# EAGLE design BRAMPS (EAGLE 7.3.0)
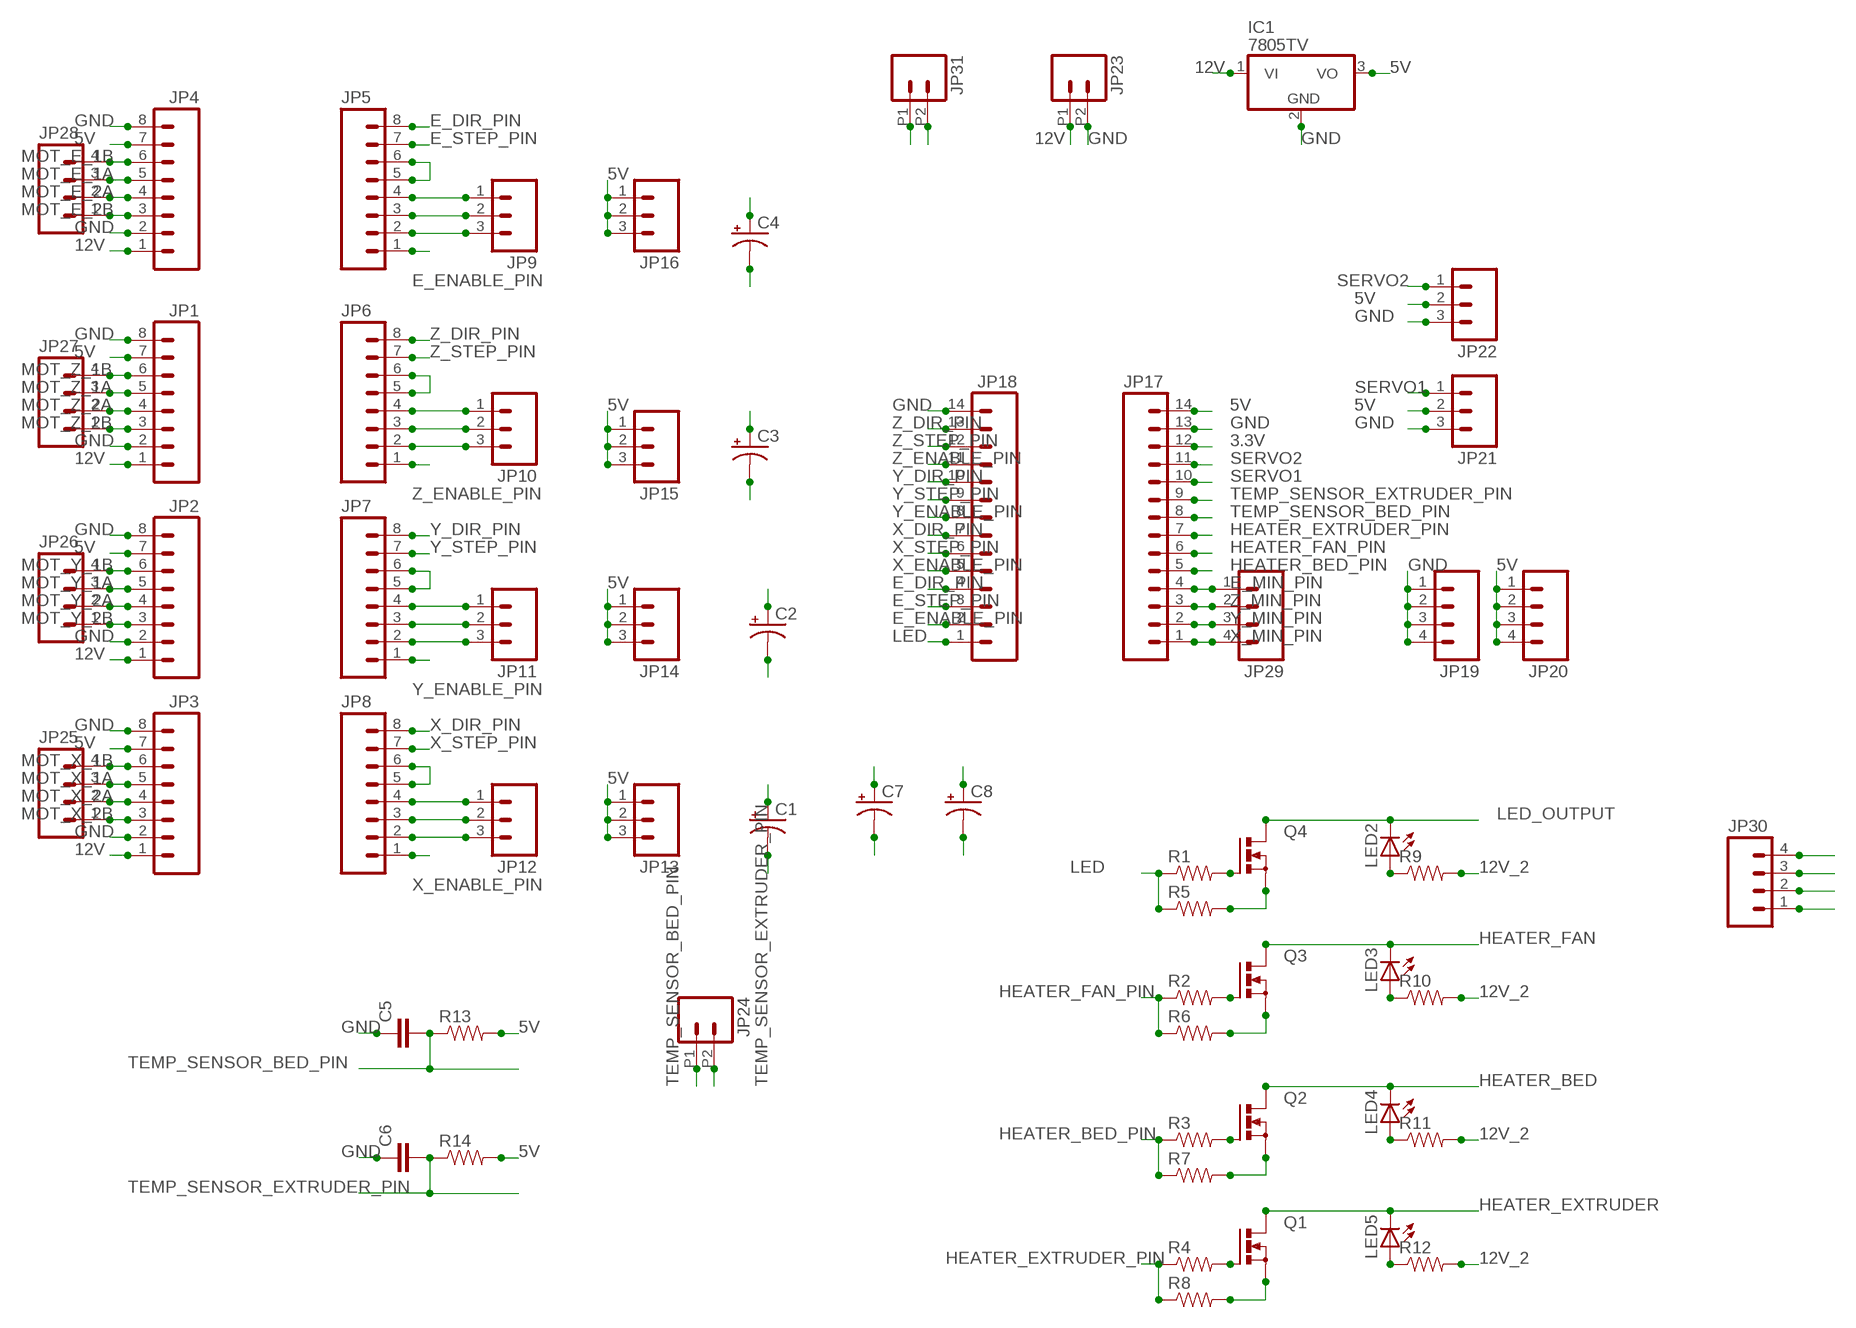
[diagram p0: schematic, sheet 1]

## Parts
C1  CAP_POLPTH2  [CPOL-RADIAL-10UF-25V]
C2  CAP_POLPTH2  [CPOL-RADIAL-10UF-25V]
C3  CAP_POLPTH2  [CPOL-RADIAL-10UF-25V]
C4  CAP_POLPTH2  [CPOL-RADIAL-10UF-25V]
C5  CAP0805  [0805]
C6  CAP0805  [0805]
C7  CAP_POLPTH2  [CPOL-RADIAL-10UF-25V]
C8  CAP_POLPTH2  [CPOL-RADIAL-10UF-25V]
IC1  7805TV  [TO220V]
JP1  M08NO_SILK_FEMALE_PTH  [1X08_NO_SILK]
JP2  M08NO_SILK_FEMALE_PTH  [1X08_NO_SILK]
JP3  M08NO_SILK_FEMALE_PTH  [1X08_NO_SILK]
JP4  M08NO_SILK_FEMALE_PTH  [1X08_NO_SILK]
JP5  M08NO_SILK_FEMALE_PTH  [1X08_NO_SILK]
JP6  M08NO_SILK_FEMALE_PTH  [1X08_NO_SILK]
JP7  M08NO_SILK_FEMALE_PTH  [1X08_NO_SILK]
JP8  M08NO_SILK_FEMALE_PTH  [1X08_NO_SILK]
JP9  M03PTH  [1X03]
JP10  M03PTH  [1X03]
JP11  M03PTH  [1X03]
JP12  M03PTH  [1X03]
JP13  M03PTH  [1X03]
JP14  M03PTH  [1X03]
JP15  M03PTH  [1X03]
JP16  M03PTH  [1X03]
JP17  M14  [1X14]
JP18  M14  [1X14]
JP19  M04NO_SILK_ALL_ROUND  [1X04_NO_SILK_ALL_ROUND]
JP20  M04NO_SILK_ALL_ROUND  [1X04_NO_SILK_ALL_ROUND]
JP21  M03PTH  [1X03]
JP22  M03PTH  [1X03]
JP23  M022.54MM_SCREWTERM  [1X02_2.54_SCREWTERM]
JP24  M022.54MM_SCREWTERM  [1X02_2.54_SCREWTERM]
JP25  M04SCREW  [SCREWTERMINAL-3.5MM-4]
JP26  M04SCREW  [SCREWTERMINAL-3.5MM-4]
JP27  M04SCREW  [SCREWTERMINAL-3.5MM-4]
JP28  M04SCREW  [SCREWTERMINAL-3.5MM-4]
JP29  M04NO_SILK_ALL_ROUND  [1X04_NO_SILK_ALL_ROUND]
JP30  M04SCREW  [SCREWTERMINAL-3.5MM-4]
JP31  M022.54MM_SCREWTERM  [1X02_2.54_SCREWTERM]
LED2  LEDCHIP-LED0805  [CHIP-LED0805]
LED3  LEDCHIP-LED0805  [CHIP-LED0805]
LED4  LEDCHIP-LED0805  [CHIP-LED0805]
LED5  LEDCHIP-LED0805  [CHIP-LED0805]
Q1  PMOSFET_NTO220BV  [TO220BV]
Q2  PMOSFET_NTO220BV  [TO220BV]
Q3  PMOSFET_NTO220BV  [TO220BV]
Q4  PMOSFET_NTO220BV  [TO220BV]
R1  RESISTOR0805-RES  [0805]
R2  RESISTOR0805-RES  [0805]
R3  RESISTOR0805-RES  [0805]
R4  RESISTOR0805-RES  [0805]
R5  RESISTOR0805-RES  [0805]
R6  RESISTOR0805-RES  [0805]
R7  RESISTOR0805-RES  [0805]
R8  RESISTOR0805-RES  [0805]
R9  RESISTOR0805-RES  [0805]
R10  RESISTOR0805-RES  [0805]
R11  RESISTOR0805-RES  [0805]
R12  RESISTOR0805-RES  [0805]
R13  RESISTOR0805-RES  [0805]
R14  RESISTOR0805-RES  [0805]

## Nets
3.3V: JP17.12
5V: C8.1(+) IC1.3(VO) JP1.7 JP2.7 JP3.7 JP4.7 JP13.1 JP13.2 JP13.3 JP14.1 JP14.2 JP14.3 JP15.1 JP15.2 JP15.3 JP16.1 JP16.2 JP16.3 JP17.14 JP20.1 JP20.2 JP20.3 JP20.4 JP21.2 JP22.2 R13.2 R14.2
12V: C1.1(+) C2.1(+) C3.1(+) C4.1(+) C7.1(+) IC1.1(VI) JP1.1 JP2.1 JP3.1 JP4.1 JP23.P1
12V_2: JP31.P1 R9.2 R10.2 R11.2 R12.2
E_DIR_PIN: JP5.8 JP18.4
E_ENABLE_PIN: JP5.1 JP18.2
E_MIN_PIN: JP17.4 JP29.1
E_STEP_PIN: JP5.7 JP18.3
GND: C1.2(-) C2.2(-) C3.2(-) C4.2(-) C5.1 C6.1 C7.2(-) C8.2(-) IC1.2(GND) JP1.2 JP1.8 JP2.2 JP2.8 JP3.2 JP3.8 JP4.2 JP4.8 JP17.13 JP18.14 JP19.1 JP19.2 JP19.3 JP19.4 JP21.3 JP22.3 JP23.P2 Q1.S Q2.S Q3.S Q4.S R5.2 R6.2 R7.2 R8.2
GND2: JP31.P2
HEATER_BED: JP30.3 LED4.C Q2.D
HEATER_BED_PIN: JP17.5 R3.1 R7.1
HEATER_EXTRUDER: JP30.1 LED5.C Q1.D
HEATER_EXTRUDER_PIN: JP17.7 R4.1 R8.1
HEATER_FAN: JP30.2 LED3.C Q3.D
HEATER_FAN_PIN: JP17.6 R2.1 R6.1
LED: JP18.1 R1.1 R5.1
LED_OUTPUT: JP30.4 LED2.C Q4.D
MOT_E_1A: JP4.5 JP28.3
MOT_E_1B: JP4.6 JP28.4
MOT_E_2A: JP4.4 JP28.2
MOT_E_2B: JP4.3 JP28.1
MOT_X_1A: JP3.5 JP25.3
MOT_X_1B: JP3.6 JP25.4
MOT_X_2A: JP3.4 JP25.2
MOT_X_2B: JP3.3 JP25.1
MOT_Y_1A: JP2.5 JP26.3
MOT_Y_1B: JP2.6 JP26.4
MOT_Y_2A: JP2.4 JP26.2
MOT_Y_2B: JP2.3 JP26.1
MOT_Z_1A: JP1.5 JP27.3
MOT_Z_1B: JP1.6 JP27.4
MOT_Z_2A: JP1.4 JP27.2
MOT_Z_2B: JP1.3 JP27.1
N$1: JP6.4 JP10.1
N$2: JP6.3 JP10.2
N$3: JP6.2 JP10.3
N$4: JP7.4 JP11.1
N$5: JP7.3 JP11.2
N$6: JP7.2 JP11.3
N$7: JP8.4 JP12.1
N$8: JP8.3 JP12.2
N$9: JP8.2 JP12.3
N$10: JP6.5 JP6.6
N$11: JP5.5 JP5.6
N$12: JP7.5 JP7.6
N$13: JP5.4 JP9.1
N$14: JP5.3 JP9.2
N$15: JP5.2 JP9.3
N$16: JP8.5 JP8.6
N$17: Q2.G R3.2
N$18: Q3.G R2.2
N$19: Q4.G R1.2
N$20: Q1.G R4.2
N$21: LED2.A R9.1
N$22: LED3.A R10.1
N$23: LED4.A R11.1
N$24: LED5.A R12.1
SERVO1: JP17.10 JP21.1
SERVO2: JP17.11 JP22.1
TEMP_SENSOR_BED_PIN: C5.2 JP17.8 JP24.P1 R13.1
TEMP_SENSOR_EXTRUDER_PIN: C6.2 JP17.9 JP24.P2 R14.1
X_DIR_PIN: JP8.8 JP18.7
X_ENABLE_PIN: JP8.1 JP18.5
X_MIN_PIN: JP17.1 JP29.4
X_STEP_PIN: JP8.7 JP18.6
Y_DIR_PIN: JP7.8 JP18.10
Y_ENABLE_PIN: JP7.1 JP18.8
Y_MIN_PIN: JP17.2 JP29.3
Y_STEP_PIN: JP7.7 JP18.9
Z_DIR_PIN: JP6.8 JP18.13
Z_ENABLE_PIN: JP6.1 JP18.11
Z_MIN_PIN: JP17.3 JP29.2
Z_STEP_PIN: JP6.7 JP18.12

## Library data of the parts
C1-C4 C7 C8 = SparkFun-Passives:CAP_POL: Capacitor Polarized These are standard SMD and PTH capacitors. Normally 10uF, 47uF, and 100uF in electrolytic and tantalum varieties. Always verify the external diameter of the through hole cap, it varies with capacity, voltage, and manufacturer. The EIA devices should be standard.
C5 C6 = SparkFun-Passives:CAP: Capacitor Standard 0603 ceramic capacitor, and 0.1" leaded capacitor.
IC1 = linear:78*: Positive VOLTAGE REGULATOR Source: http://cache.national.com/ds/LM/LM78L05.pdf http://www.fairchildsemi.com/ds/LM/LM7805.pdf
JP1-JP8 = SparkFun-Connectors:M08: Header 8 Standard 8-pin 0.1" header. Use with straight break away headers (SKU : PRT-00116), right angle break away headers (PRT-00553), swiss pins (PRT-00743), machine pins (PRT-00117), and female headers (PRT-00115).; PROD_ID: CONN-08438
JP9-JP16 JP21 JP22 = SparkFun-Connectors:M03: Header 3 Standard 3-pin 0.1" header. Use with straight break away headers (SKU : PRT-00116), right angle break away headers (PRT-00553), swiss pins (PRT-00743), machine pins (PRT-00117), and female headers (PRT-00115). Molex polarized connector foot print use with SKU : PRT-08232 with associated crimp pins and housings.
JP17 JP18 = SparkFun-Connectors:M14: Header 14 Standard 14-pin 0.1" header. Use with straight break away headers (SKU : PRT-00116), right angle break away headers (PRT-00553), swiss pins (PRT-00743), machine pins (PRT-00117), and female headers (PRT-00115).
JP19 JP20 JP29 = SparkFun-Connectors:M04: Header 4 Standard 4-pin 0.1" header. Use with straight break away headers (SKU : PRT-00116), right angle break away headers (PRT-00553), swiss pins (PRT-00743), machine pins (PRT-00117), and female headers (PRT-00115). Molex polarized connector foot print use with SKU : PRT-08231 with associated crimp pins and housings. 1MM SMD Version SKU: PRT-10208
JP23 JP24 JP31 = SparkFun-Connectors:M02: Standard 2-pin 0.1" header. Use with - straight break away headers ( PRT-00116) - right angle break away headers (PRT-00553) - swiss pins (PRT-00743) - machine pins (PRT-00117) - female headers (PRT-00115) Molex polarized connector foot print use with: PRT-08233 with associated crimp pins and housings. 2.54_SCREWTERM for use with PRT-10571. 3.5mm Screw Terminal footprints for PRT-08084 5mm Screw Terminal footprints for use with PRT-08432
JP25-JP28 JP30 = SparkFun-Connectors:M04: Header 4 Standard 4-pin 0.1" header. Use with straight break away headers (SKU : PRT-00116), right angle break away headers (PRT-00553), swiss pins (PRT-00743), machine pins (PRT-00117), and female headers (PRT-00115). Molex polarized connector foot print use with SKU : PRT-08231 with associated crimp pins and housings. 1MM SMD Version SKU: PRT-10208; PROD_ID: Combine 2x8399
LED2-LED5 = adafruit:LED: LED OSRAM: - CHIPLED LG R971, LG N971, LY N971, LG Q971, LY Q971, LO R971, LY R971 LH N974, LH R974 LS Q976, LO Q976, LY Q976 LO Q996 - Hyper CHIPLED LW Q18S LB Q993, LB Q99A, LB R99A - SideLED LS A670, LO A670, LY A670, LG A670, LP A670 LB A673, LV A673, LT A673, LW A673 LH A674 LY A675 LS A676, LA A676, LO A676, LY A676, LW A676 LS A679, LY A679, LG A679 - Hyper Micro SIDELED® LS Y876, LA Y876, LO Y876, LY Y876 LT Y87S - SmartLED LW L88C, LW L88S LB L89C, LB L89S, LG L890 LS L89K, LO L89K, LY L89K LS L896, LA L896, LO L896, LY L896 - TOPLED LS T670, LO T670, LY T670, LG T670, LP T670 LSG T670, LSP T670, LSY T670, LOP T670, LYG T670 LG T671, LOG T671, LSG T671 LB T673, LV T673, LT T673, LW T673 LH T674 LS T676, LA T676, LO T676, LY T676, LB T676, LH T676, LSB T676, LW T676 LB T67C, LV T67C, LT T67C, LS T67K, LO T67K, LY T67K, LW E67C LS E67B, LA E67B, LO E67B, LY E67B, LB E67C, LV E67C, LT E67C LW T67C LS T679, LY T679, LG T679 LS T770, LO T770, LY T770, LG T770, LP T770 LB T773, LV T773, LT T773, LW T773 LH T774 LS E675, LA E675, LY E675, LS T675 LS T776, LA T776, LO T776, LY T776, LB T776 LHGB T686 LT T68C, LB T68C - Hyper Mini TOPLED® LB M676 - Mini TOPLED Santana® LG M470 LS M47K, LO M47K, LY M47K Source: http://www.osram.convergy.de/
Q1-Q4 = transistor-power:PMOSFET_N: Power MOSFET N-Channel
R1-R14 = SparkFun-Resistors:RESISTOR: Resistor Basic schematic elements and footprints for 0603, 1206, and PTH resistors.

## Board
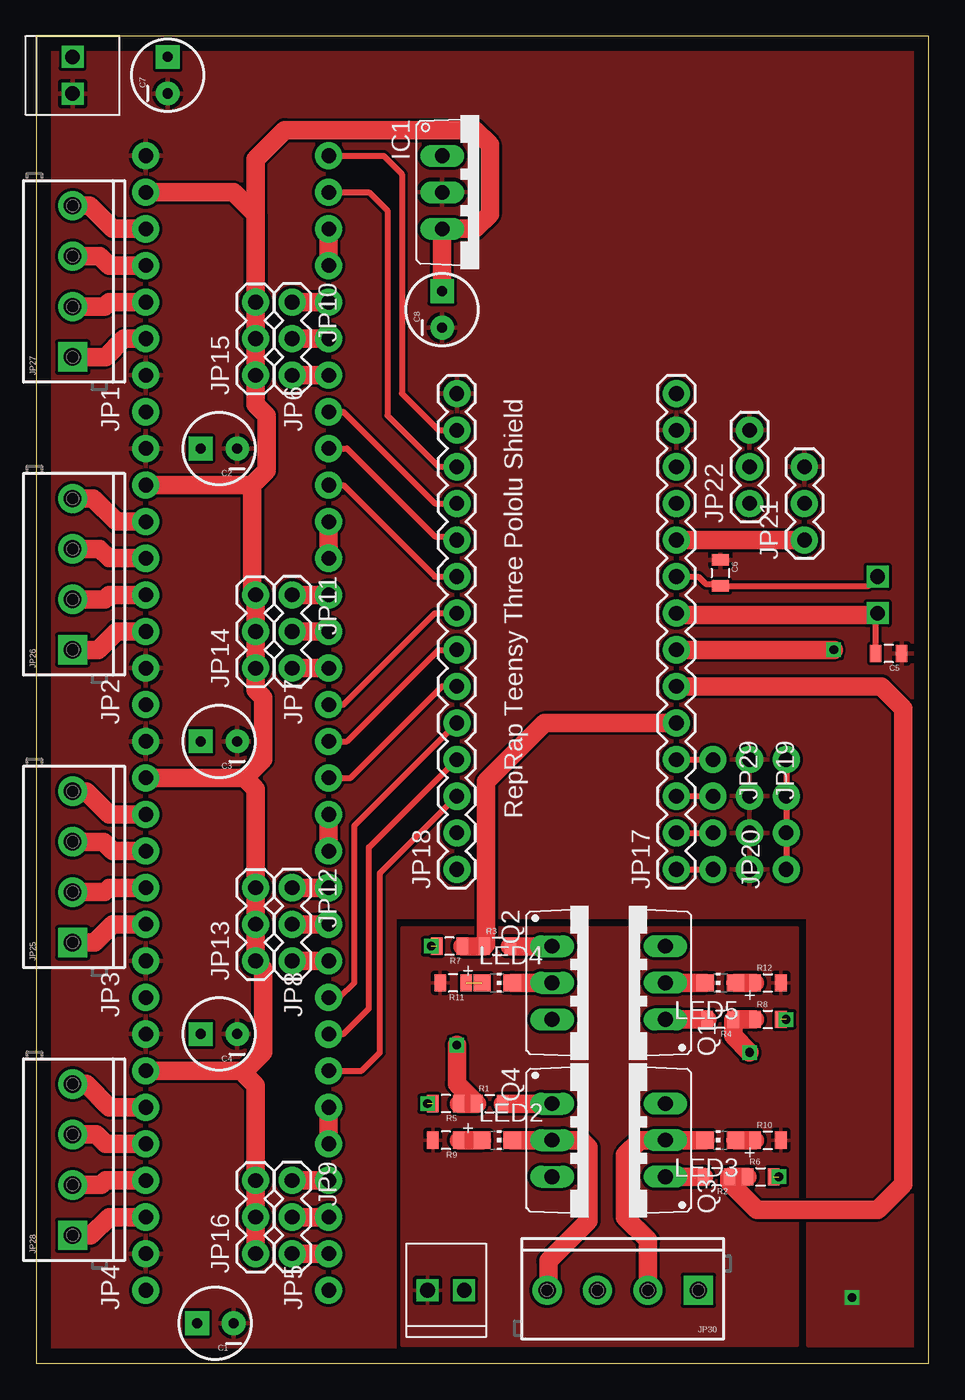
[diagram p1: board, top side]
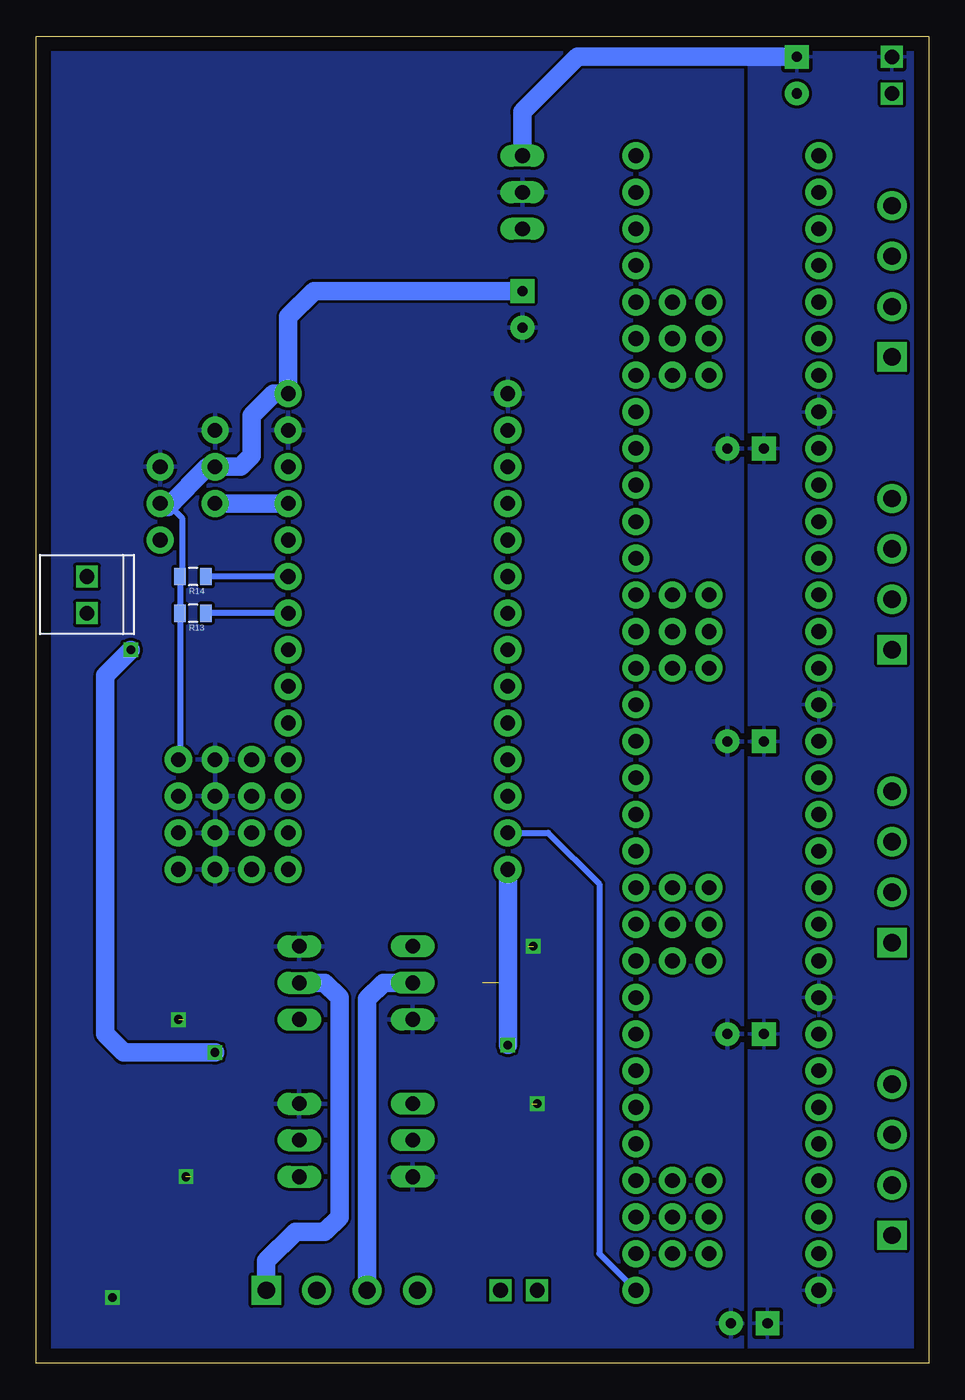
[diagram p2: board, bottom side, seen from below]

Size 61.96 x 92.13 mm. Coordinates in mm from the lower left corner, seen from the top.
Outline: 0,0 61.96,0 61.96,92.13 0,92.13 0,0
Copper layers (1*16): Top 0.035mm / dielectric 1.5mm / Bottom 0.035mm
Design rules "default": minimum track width 10mil, minimum drill 24mil, track to track 8mil, track to pad 8mil, pad to pad 8mil, via to via 8mil, smd to smd 8mil, copper to edge 40mil, drill to drill 8mil, minimum pad ring 10mil, minimum via ring 8mil, stop-mask expansion 4mil, vias tented up to drill 0mil, thermal gap 10mil

### Footprints (pad centres in the part's own frame; a part is rotated, then mirrored left to right if it is on the bottom)
CPOL-RADIAL-10UF-25V = drill 0.7 pad 1.651 square: 1 1.27,0 | drill 0.7 pad 1.651: 2 -1.27,0
0805 = smd 0.8 x 1.2: 1 -0.9,0; 2 0.9,0
TO220V = drill 1.016 long: 1 -2.54,-2.54; 2 0,-2.54; 3 2.54,-2.54
1X08_NO_SILK = drill 1.016 pad 1.88: 1 0,0; 2 2.54,0; 3 5.08,0; 4 7.62,0; 5 10.16,0; 6 12.7,0; 7 15.24,0; 8 17.78,0
1X03 = drill 1.016 pad 1.88: 1 0,0; 2 2.54,0; 3 5.08,0
1X14 = drill 1.016 pad 1.88: 1 0,0; 2 2.54,0; 3 5.08,0; 4 7.62,0; 5 10.16,0; 6 12.7,0; 7 15.24,0; 8 17.78,0; 9 20.32,0; 10 22.86,0; 11 25.4,0; 12 27.94,0; 13 30.48,0; 14 33.02,0
1X04_NO_SILK_ALL_ROUND = drill 1.016 pad 1.88: 1 0,0; 2 2.54,0; 3 5.08,0; 4 7.62,0
1X02_2.54_SCREWTERM = drill 1.016 square: P1 2.54,0; P2 0,0
SCREWTERMINAL-3.5MM-4 = drill 1.2 pad 2.032 square: 1 0,0 | drill 1.2 pad 2.032: 2 3.5,0; 3 7,0; 4 10.5,0
CHIP-LED0805 = smd 1.2 x 1.2: A 0,-1.05; C 0,1.05
TO220BV = drill 1.016 long: D 0,-2.54; G -2.54,-2.54; S 2.54,-2.54

### Placement (x,y rotation side)
C1  12.45,2.79 180 top
C2  12.7,63.5 180 top
C3  12.7,43.18 180 top
C4  12.7,22.86 180 top
C5  59.18,49.28 180 top
C6  47.5,54.86 270 top
C7  9.14,89.41 90 top
C8  28.19,73.15 90 top
IC1  30.73,81.28 270 top
JP1  7.62,66.04 90 top
JP2  7.62,45.72 90 top
JP3  7.62,25.4 90 top
JP4  7.62,5.08 90 top
JP5  20.32,5.08 90 top
JP6  20.32,66.04 90 top
JP7  20.32,45.72 90 top
JP8  20.32,25.4 90 top
JP9  17.78,12.7 270 top
JP10  17.78,73.66 270 top
JP11  17.78,53.34 270 top
JP12  17.78,33.02 270 top
JP13  15.24,27.94 90 top
JP14  15.24,48.26 90 top
JP15  15.24,68.58 90 top
JP16  15.24,7.62 90 top
JP17  44.45,34.29 90 top
JP18  29.21,34.29 90 top
JP19  49.53,41.91 270 top
JP20  52.07,34.29 90 top
JP21  53.34,57.15 90 top
JP22  49.53,59.69 90 top
JP23  2.54,88.14 90 top
JP24  58.42,54.61 270 bottom
JP25  2.54,29.21 90 top
JP26  2.54,49.53 90 top
JP27  2.54,69.85 90 top
JP28  2.54,8.89 90 top
JP29  46.99,41.91 270 top
JP30  45.97,5.08 180 top
JP31  29.72,5.08 180 top
LED2  32,15.49 270 top
LED3  47.5,15.49 90 top
LED4  32,26.42 270 top
LED5  47.5,26.42 90 top
Q1  41.15,26.42 90 top
Q2  38.35,26.42 270 top
Q3  41.15,15.49 90 top
Q4  38.35,15.49 270 top
R1  31.5,18.03 0 top
R2  47.24,12.95 180 top
R3  32,28.96 0 top
R4  47.5,23.88 180 top
R5  28.45,18.03 180 top
R6  50.29,12.95 0 top
R7  28.7,28.96 180 top
R8  50.8,23.88 0 top
R9  28.45,15.49 180 top
R10  50.8,15.49 0 top
R11  28.96,26.42 180 top
R12  50.8,26.42 0 top
R13  51.05,52.07 180 bottom
R14  51.05,54.61 180 bottom

### Tracks (layer width: path | path; a pad name or v marks a point on that pad's centre or on a via)
5V
  Top 0.406: JP20.4 JP20.3 JP20.2 JP20.1
  Top 1.27: JP1.7 13.72,81.28 15.24,79.76 JP15.3 | JP15.3 JP15.2 JP15.1 15.24,66.55 16,65.79 16,61.98 14.99,60.96 | JP2.7 14.99,60.96 | 14.99,60.96 14.99,53.59 JP14.3 JP14.2 JP14.1 15.24,46.74 15.75,46.23 15.75,41.91 14.48,40.64 | JP4.7 14.48,20.32 | 14.48,20.32 15.75,21.59 15.75,27.43 JP13.1 JP13.2 JP13.3 15.24,39.88 14.48,40.64 | JP3.7 14.48,40.64 | 14.48,20.32 14.48,20.07 15.24,19.3 JP16.3 JP16.2 JP16.1 | C8.1 IC1.3 30.48,78.74 31.5,79.76 31.5,84.58 30.48,85.6 17.27,85.6 15.24,83.57 JP15.3
  Bottom 0.406: 52.83,59.44 52.58,59.44 51.82,58.67 51.82,54.75 R14.2 R13.2 51.95,42.03 JP20.4
  Bottom 1.27: C8.1 42.67,74.42 44.45,72.64 JP17.14 45.47,67.31 46.99,65.79 46.99,62.99 47.75,62.23 JP22.2 50.04,62.23 52.83,59.44 53.09,59.44 JP21.2
12V
  Bottom 1.27: C7.1 24.38,90.68 28.19,86.87 IC1.1
  pour Bottom: 0,92.46 12.45,92.46 12.45,-0.76 0,-0.76
12V_2
  pour Top: 25.4,30.23 52.83,30.23 52.83,1.27 25.4,1.27
E_DIR_PIN
  Top 0.406: JP5.8 21.34,22.86 23.11,24.64 23.11,35.81 JP18.4
E_ENABLE_PIN
  Bottom 0.406: JP18.2 26.42,36.83 22.86,33.27 22.86,7.62 JP5.1
E_MIN_PIN
  Top 0.406: JP17.4 JP29.1
E_STEP_PIN
  Top 0.406: JP5.7 22.61,20.32 23.88,21.59 23.88,34.04 JP18.3
GND  (via drill 0.6)  (4 unrouted)
  other vias: 27.43,28.96 52.07,23.88 51.56,12.95 27.18,18.03 56.64,4.57
  pour Bottom: 12.95,92.2 159.51,92.2 159.51,-8.13 12.95,-8.64
  pour Top: 0,1.02 24.89,1.02 24.89,30.99 53.59,30.99 53.59,1.27 160.27,1.27 160.27,92.2 0,92.2
HEATER_BED
  Top 1.27: LED4.C Q2.D
  Bottom 1.27: JP30.3 38.97,25.29 37.85,26.42 Q2.D
HEATER_BED_PIN
  Top 1.27: R7.1 R3.1 31.24,29.09 31.24,40.39 35.31,44.45 JP17.5
HEATER_EXTRUDER
  Top 1.27: Q1.D LED5.C
  Bottom 1.27: JP30.1 45.97,7.11 43.94,9.14 41.91,9.14 40.89,10.16 40.89,25.4 41.91,26.42 Q1.D
HEATER_EXTRUDER_PIN  (via drill 0.6)
  Top 1.27: R8.1 R4.1 48.4,22.72 v49.53,21.59 | v55.37,49.53 JP17.7
  Bottom 1.27: v49.53,21.59 55.88,21.59 57.15,22.86 57.15,47.75 v55.37,49.53
HEATER_FAN
  Top 1.27: LED3.C Q3.D 41.91,15.49 40.89,14.48 40.89,10.16 42.47,8.58 JP30.2
HEATER_FAN_PIN
  Top 1.27: R6.1 R2.1 48.14,12.56 50.04,10.67 58.42,10.67 60.2,12.45 60.2,45.47 58.67,46.99 JP17.6
LED  (via drill 0.6)
  Top 1.27: R5.1 R1.1 29.21,19.42 v29.21,22.1
  Bottom 1.27: JP18.1 v29.21,22.1
LED_OUTPUT
  Top 1.27: LED2.C Q4.D 37.85,15.49 38.35,14.99 38.35,9.91 35.56,7.11 35.56,5.17 JP30.4
MOT_E_1A
  Top 1.27: JP28.3 4.18,15.89 4.83,15.24 JP4.5
MOT_E_1B
  Top 1.27: JP28.4 3.47,19.39 5.08,17.78 JP4.6
MOT_E_2A
  Top 1.27: JP28.2 4.52,12.39 4.83,12.7 JP4.4
MOT_E_2B
  Top 1.27: JP28.1 3.81,8.89 5.08,10.16 JP4.3
MOT_X_1A
  Top 1.27: JP25.3 4.68,36.21 5.33,35.56 JP3.5
MOT_X_1B
  Top 1.27: JP25.4 3.47,39.71 5.08,38.1 JP3.6
MOT_X_2A
  Top 1.27: JP25.2 4.77,32.71 5.08,33.02 JP3.4
MOT_X_2B
  Top 1.27: JP25.1 4.06,29.21 5.33,30.48 JP3.3
MOT_Y_1A
  Top 1.27: JP26.3 4.43,56.53 5.08,55.88 JP2.5
MOT_Y_1B
  Top 1.27: JP26.4 3.98,60.03 5.59,58.42 JP2.6
MOT_Y_2A
  Top 1.27: JP26.2 4.77,53.03 5.08,53.34 JP2.4
MOT_Y_2B
  Top 1.27: JP26.1 4.32,49.53 5.59,50.8 JP2.3
MOT_Z_1A
  Top 1.27: JP27.3 4.43,76.85 5.08,76.2 JP1.5
MOT_Z_1B
  Top 1.27: JP27.4 3.72,80.35 5.33,78.74 JP1.6
MOT_Z_2A
  Top 1.27: JP27.2 4.77,73.35 5.08,73.66 JP1.4
MOT_Z_2B
  Top 1.27: JP27.1 4.83,69.85 6.1,71.12 JP1.3
N$1
  Top 1.27: JP6.4 JP10.1
N$2
  Top 1.27: JP6.3 JP10.2
N$3
  Top 1.27: JP6.2 JP10.3
N$4
  Top 1.27: JP11.1 JP7.4
N$5
  Top 1.27: JP7.3 JP11.2
N$6
  Top 1.27: JP11.3 JP7.2
N$7
  Top 1.27: JP12.1 JP8.4
N$8
  Top 1.27: JP12.2 JP8.3
N$9
  Top 1.27: JP12.3 JP8.2
N$10
  Top 1.27: JP6.5 JP6.6
N$11
  Top 1.27: JP5.5 JP5.6
N$12
  Top 1.27: JP7.5 JP7.6
N$13
  Top 1.27: JP9.1 JP5.4
N$14
  Top 1.27: JP9.2 JP5.3
N$15
  Top 1.27: JP9.3 JP5.2
N$16
  Top 1.27: JP8.5 JP8.6
N$17
  Top 1.27: R3.2 Q2.G
N$18
  Top 1.27: Q3.G R2.2
N$19
  Top 1.27: Q4.G R1.2
N$20
  Top 1.27: Q1.G R4.2
N$21
  Top 1.27: R9.1 LED2.A
N$22
  Top 1.27: R10.1 LED3.A
N$23  (1 unrouted)
N$24
  Top 1.27: R12.1 LED5.A
SERVO1
  Top 1.27: JP17.10 JP21.1
SERVO2
  Bottom 1.27: JP17.11 JP22.1
TEMP_SENSOR_BED_PIN
  Top 0.406: C5.2 58.3,51.95 JP24.P1
  Top 1.27: 58.3,51.95 44.57,51.95 JP17.8
  Bottom 0.406: JP17.8 R13.1
TEMP_SENSOR_EXTRUDER_PIN  (via drill 0.6)
  Top 0.406: JP17.9 v44.7,54.61 45.97,54.61 46.48,54.1 47.36,54.1 C6.2 57.77,53.96 JP24.P2
  Bottom 0.406: v44.7,54.61 R14.1
X_DIR_PIN
  Top 0.406: JP8.8 21.59,43.18 27.94,49.53 JP18.7
X_ENABLE_PIN
  Top 0.406: JP8.1 21.08,25.4 22.1,26.42 22.1,37.34 JP18.5
X_MIN_PIN
  Top 0.406: JP17.1 JP29.4
X_STEP_PIN
  Top 0.406: JP8.7 21.84,40.64 28.19,46.99 JP18.6
Y_DIR_PIN
  Top 0.406: JP7.8 21.59,63.5 27.69,57.4 28.96,57.4 JP18.10
Y_ENABLE_PIN
  Top 0.406: JP7.1 21.34,45.72 27.69,52.07 JP18.8
Y_MIN_PIN
  Top 0.406: JP17.2 JP29.3
Y_STEP_PIN
  Top 0.406: JP7.7 21.34,60.96 27.69,54.61 JP18.9
Z_DIR_PIN
  Top 0.406: JP6.8 24.13,83.82 25.4,82.55 25.4,67.31 27.94,64.77 JP18.13
Z_ENABLE_PIN
  Top 0.406: JP6.1 21.34,66.04 27.69,59.69 JP18.11
Z_MIN_PIN
  Top 0.406: JP17.3 JP29.2
Z_STEP_PIN
  Top 0.406: JP6.7 23.11,81.28 24.38,80.01 24.38,65.79 27.94,62.23 JP18.12

### Text on the board
tNames: RepRap Teensy Three Pololu Shield